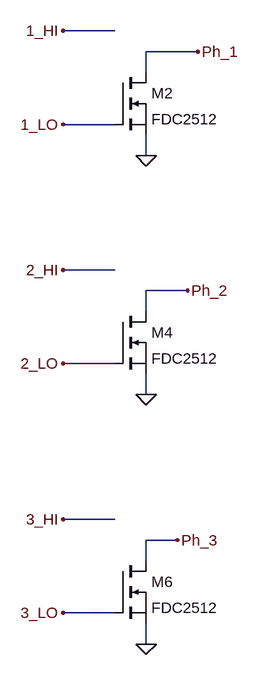
[diagram p0: schematic MotorDriver.asc]
MotorDriver.asc, the LTspice schematic file:
Version 4
SHEET 1 880 1188
WIRE 160 224 80 224
WIRE 288 256 208 256
WIRE 208 288 208 256
WIRE 160 368 80 368
WIRE 208 416 208 384
WIRE 160 592 80 592
WIRE 272 624 208 624
WIRE 208 656 208 624
WIRE 160 736 80 736
WIRE 208 784 208 752
WIRE 160 976 80 976
WIRE 256 1008 208 1008
WIRE 208 1040 208 1008
WIRE 160 1120 80 1120
WIRE 208 1168 208 1136
FLAG 208 1168 0
FLAG 80 224 1_HI
FLAG 80 368 1_LO
FLAG 80 592 2_HI
FLAG 80 736 2_LO
FLAG 80 976 3_HI
FLAG 80 1120 3_LO
FLAG 288 256 Ph_1
FLAG 272 624 Ph_2
FLAG 256 1008 Ph_3
FLAG 208 416 0
FLAG 208 784 0
SYMBOL nmos 160 288 R0
SYMATTR InstName M2
SYMATTR Value FDC2512
SYMBOL nmos 160 656 R0
SYMATTR InstName M4
SYMATTR Value FDC2512
SYMBOL nmos 160 1040 R0
SYMATTR InstName M6
SYMATTR Value FDC2512

The netlist it stands for:
* MotorDriver.asc
M2 Ph_1 1_LO 0 0 FDC2512
M4 Ph_2 2_LO 0 0 FDC2512
M6 Ph_3 3_LO 0 0 FDC2512
.model NMOS NMOS
.model PMOS PMOS
.lib standard.mos
.backanno
.end